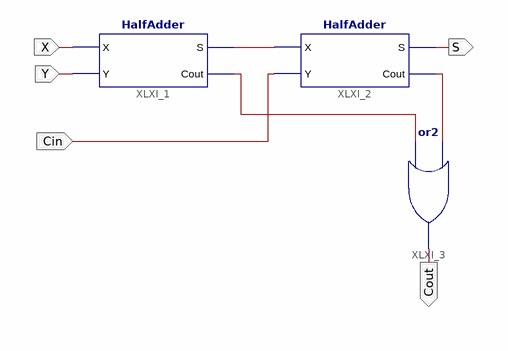
[diagram p0: schematic sheet 1]
// Xilinx ISE schematic FullAdder.sch (spartan6) as structural Verilog: 3 symbols, 5 ports
module FullAdder (
  input  Cin,
  input  X,
  input  Y,
  output S,
  output Cout
);

  wire XLXN_1, XLXN_2, XLXN_3;

  HalfAdder XLXI_1 (.X(X), .Y(Y), .S(XLXN_1), .Cout(XLXN_3));
  HalfAdder XLXI_2 (.X(XLXN_1), .Y(Cin), .S(S), .Cout(XLXN_2));
  or XLXI_3 (Cout, XLXN_3, XLXN_2);
endmodule
